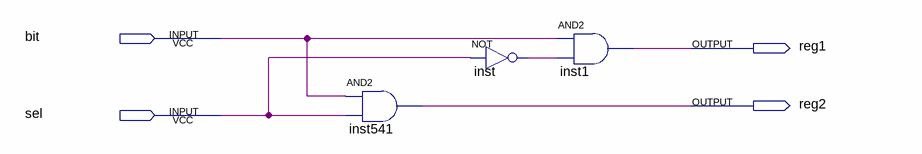
[diagram p0: schematic sheet]
// Quartus schematic demux1x2.bdf as structural Verilog: 3 symbols, 4 pins
module demux1x2 (
  input  \bit ,
  input  sel,
  output reg1,
  output reg2
);

  wire inst_out;

  and inst541 (reg2, \bit , sel);
  not inst (inst_out, sel);
  and inst1 (reg1, \bit , inst_out);
endmodule
